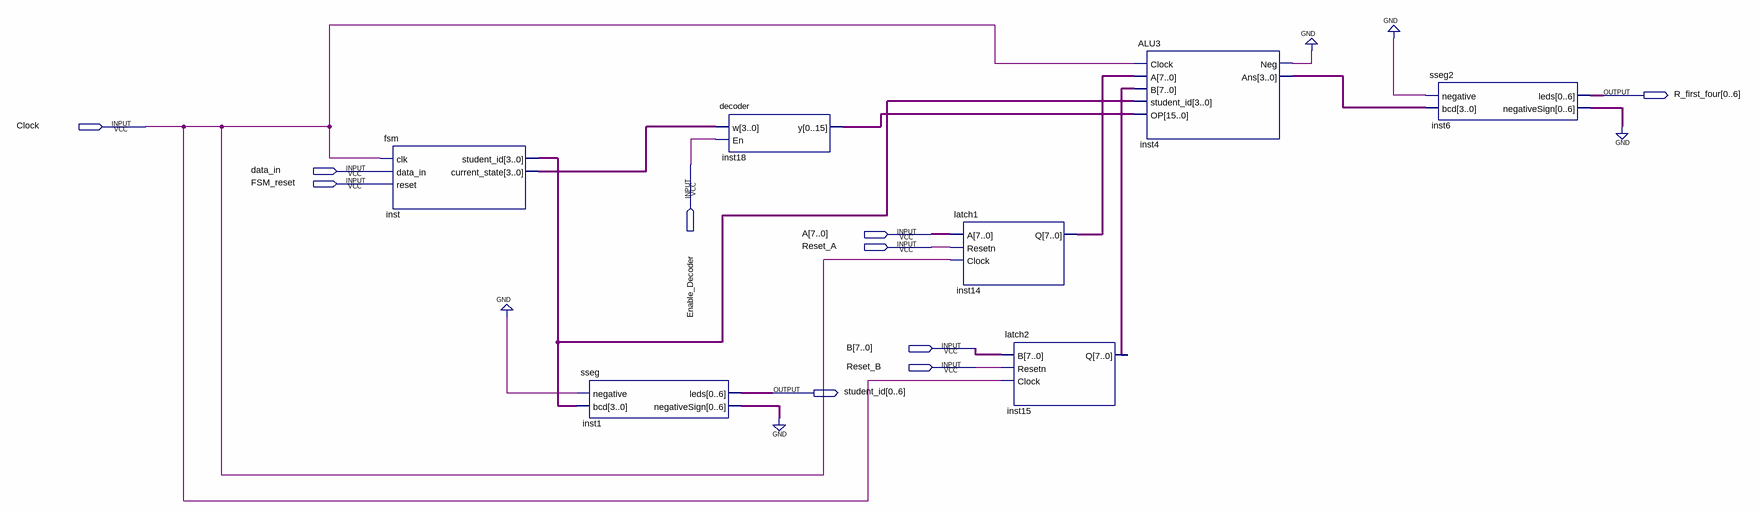
[diagram p0: schematic sheet]
// Quartus schematic part3.bdf as structural Verilog: 7 symbols, 10 pins
module part3 (
  input  Clock,
  input  Enable_Decoder,
  input  data_in,
  input  FSM_reset,
  input  [7:0] A,
  input  Reset_A,
  input  [7:0] B,
  input  Reset_B,
  output [0:6] R_first_four,
  output [0:6] student_id
);

  wire inst4_neg;
  wire [3:0] inst4_ans, inst_current_state, inst_student_id;
  wire [6:0] inst1_negativesign, inst6_negativesign;
  wire [7:0] inst14_q, inst15_q;
  wire [15:0] inst18_y;

  fsm inst (
    .clk(Clock), .data_in(data_in), .reset(FSM_reset), .student_id(inst_student_id),
    .current_state(inst_current_state));
  sseg inst1 (.negative(1'b0), .bcd(inst_student_id), .leds(student_id), .negativeSign(inst1_negativesign));
  decoder inst18 (.w(inst_current_state), .En(Enable_Decoder), .y(inst18_y));
  latch1 inst14 (.A(A), .Resetn(Reset_A), .Clock(Clock), .Q(inst14_q));
  latch2 inst15 (.B(B), .Resetn(Reset_B), .Clock(Clock), .Q(inst15_q));
  ALU3 inst4 (
    .Clock(Clock), .A(inst14_q), .B(inst15_q), .student_id(inst_student_id), .OP(inst18_y), .Neg(inst4_neg),
    .Ans(inst4_ans));
  sseg2 inst6 (.negative(1'b0), .bcd(inst4_ans), .leds(R_first_four), .negativeSign(inst6_negativesign));
  // also tied to GND on the sheet: {inst1_negativesign[0], inst1_negativesign[1], inst1_negativesign[2], inst1_negativesign[3], inst1_negativesign[4], inst1_negativesign[5], inst1_negativesign[6], inst4_neg, inst6_negativesign[0], inst6_negativesign[1], inst6_negativesign[2], inst6_negativesign[3], inst6_negativesign[4], inst6_negativesign[5], inst6_negativesign[6]}
endmodule
